# Altium schematic sheet PowerAmplifier915MHz.SchDoc
size A4
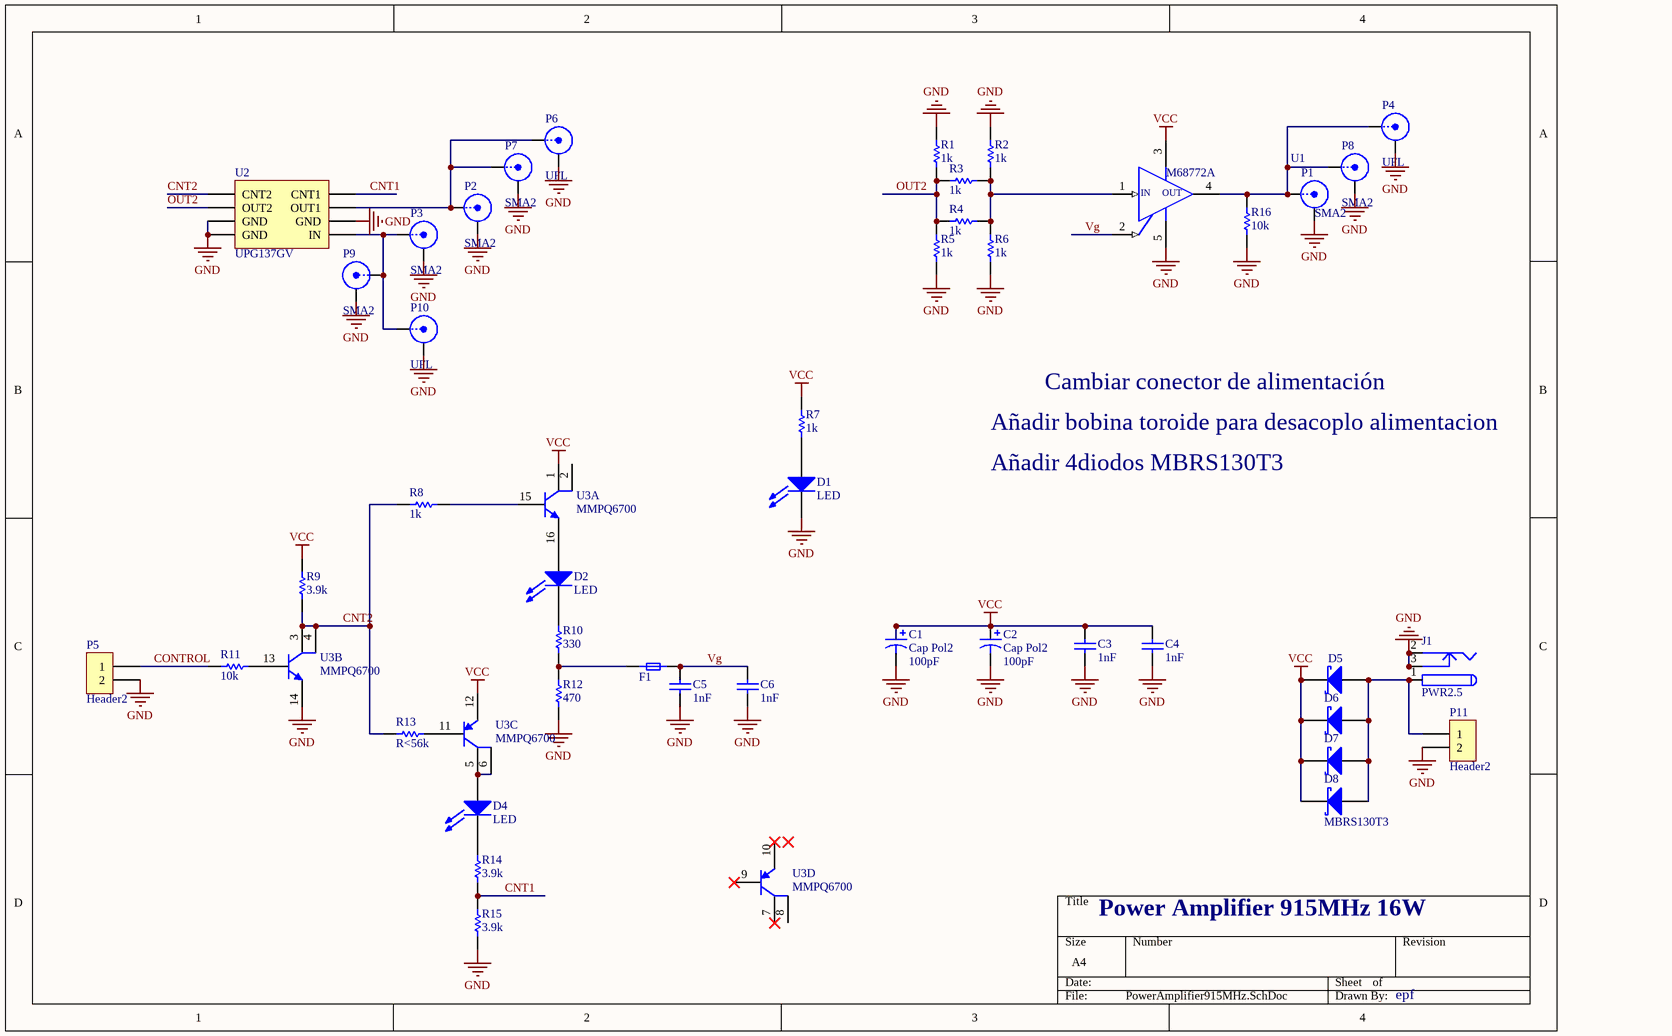
[diagram p0: PowerAmplifier915MHz.SchDoc]

## Parts
C1  Cap Pol2  value 100pF  [TC7360-2924]
C2  Cap Pol2  value 100pF  [TC7360-2924]
C3  value 1nF  [0805_CAP]  (hidden comment: Capacitor)
C4  value 1nF  [0805_CAP]  (hidden comment: Capacitor)
C5  value 1nF  [0805_CAP]  (hidden comment: Capacitor)
C6  value 1nF  [0805_CAP]  (hidden comment: Capacitor)
D1  LED  [LED0603]
D2  LED  [LED0603]
D4  LED  [LED0603]
D5  MBRS130T3  [MBRS130T3]  (value not drawn)
D6  MBRS130T3  [MBRS130T3]  (value not drawn)
D7  MBRS130T3  [MBRS130T3]  (value not drawn)
D8  MBRS130T3  [MBRS130T3]
F1  Ferrita  [IND0603]  (value not drawn)
J1  PWR2.5  [KLD-0202]
P1  SMA2  [SMAL_Antena]
P2  SMA2  [SMAL_Antena]
P3  SMA2  [SMAL22]
P4  UFL  [UFL]
P5  Header2  [Header2Macho]
P6  UFL  [UFL]
P7  SMA2  [SMA-4HOLE]
P8  SMA2  [SMA-4HOLE]
P9  SMA2  [SMA-4HOLE]
P10  UFL  [UFL]
P11  Header2  [Header2Macho]
R1  value 1k  [RES0805]  (hidden comment: Resistor)
R2  value 1k  [RES0805]  (hidden comment: Resistor)
R3  value 1k  [RES0805]  (hidden comment: Resistor)
R4  value 1k  [RES0805]  (hidden comment: Resistor)
R5  value 1k  [RES0805]  (hidden comment: Resistor)
R6  value 1k  [RES0805]  (hidden comment: Resistor)
R7  value 1k  [RES0805]  (hidden comment: Resistor)
R8  value 1k  [RES0805]  (hidden comment: Resistor)
R9  value 3.9k  [RES0805]  (hidden comment: Resistor)
R10  value 330  [RES0805]  (hidden comment: Resistor)
R11  value 10k  [RES0805]  (hidden comment: Resistor)
R12  value 470  [RES0805]  (hidden comment: Resistor)
R13  value R<56k  [RES0805]  (hidden comment: Resistor)
R14  value 3.9k  [RES0805]  (hidden comment: Resistor)
R15  value 3.9k  [RES0805]  (hidden comment: Resistor)
R16  value 10k  [RES0805]  (hidden comment: Resistor)
U1  M68772A  [M68772A]
U2  UPG137GV  [SOP65P640-8L]
U3  MMPQ6700  [SOIC127P602-16BN]  (parts A,B,C,D of 4)

## Nets
GND: C1.2 C2.2 C3.1 C4.1 C5.1 C6.1 D1.2(K) J1.2 J1.2A J1.2B J1.3 J1.3A J1.3B P1.0(Y) P2.0(Y) P3.0(Y) P4.2(Y) P5.2 P6.2(Y) P7.0(Y) P8.0(Y) P9.0(Y) P10.2(Y) P11.2 R1.1 R2.1 R5.2 R6.2 R12.1 R15.1 R16.2 U1.5(GND) U2.3(GND) U2.4(GND) U2.6(GND) U3.14(E)
VCC: C1.1 C2.1 C3.2 C4.2 D5.2(K) D6.2(K) D7.2(K) D8.2(K) R7.2 R9.2 U1.3(Vdd) U3.1(C) U3.12(E)
CNT1: R14.1 R15.2 U2.8(CNT1)
CNT2: R8.1 R9.1 R13.1 U2.1(CNT2) U3.3(C) U3.4(C)
CONTROL: P5.1 R11.1
OUT2: R1.2 R3.1 R4.1 R5.1 U2.2(OUT2)
Vg: C5.2 C6.2 F1.2 U1.2(Vgg)
NetD1_1: D1.1(A) R7.1
NetD2_1: D2.1(A) U3.16(E)
NetD2_2: D2.2(K) R10.2
NetD4_1: D4.1(A) U3.5(C) U3.6(C)
NetD4_2: D4.2(K) R14.2
NetD5_1: D5.1(A) D6.1(A) D7.1(A) D8.1(A) J1.1 J1.1A J1.1B P11.1
NetF1_1: F1.1 R10.1 R12.2
NetP1_1: P1.1(X) P4.1(X) P8.1(X) R16.1 U1.4(OUT)
NetP2_1: P2.1(X) P6.1(X) P7.1(X) U2.7(OUT1)
NetP3_1: P3.1(X) P9.1(X) P10.1(X) U2.5(IN)
NetR2_2: R2.2 R3.2 R4.2 R6.1 U1.1(IN)
NetR8_2: R8.2 U3.15(B)
NetR11_2: R11.2 U3.13(B)
NetR13_2: R13.2 U3.11(B)

Not connected (* = marked no-connect by the designer): U3 2(C) 7(C)* 8(C) 9(B)* 10(E)*

## Notes on the sheet
- Añadir bobina toroide para desacoplo alimentacion
- Cambiar conector de alimentación
- Añadir 4diodos MBRS130T3
- Power Amplifier 915MHz 16W
- epf

## Library data of the parts
C1 C2 = Cap Pol2: Polarized Capacitor (Axial); Published: 8-Jun-2000; LatestRevisionDate: 17-Jul-2002; LatestRevisionNote: Re-released for DXP Platform.; PackageReference: POLAR0.8; Publisher: Altium Limited
C3-C6 = Cap
D1 D2 D4 = LED1
D5-D8 = MBRS130T3: DIODO 1A 30V
J1 = PWR2.5: Low Voltage Power Supply Connector; Published: 17-Dec-2003; DatasheetDocument: 09-May-2002; Publisher: Altium Limited; ComponentLink1Description: Manufacturer Link; ComponentLink1URL: http://domino.kycon.com/internet/Products.html
P1-P3 P7-P9 = SMA2: BNC Elbow Connector; LatestRevisionDate: 17-Jul-2002; LatestRevisionNote: Re-released for DXP Platform.; Publisher: Altium Limited
R1-R16 = Res
U1 = M68772A: AMPLIFICADOR DE POTENCIA 915MHz
U2 = UPG137GV: L-Band SPDT GaAs MMIC SWITCH
U3 = MMPQ6700: Quad NPN & PNP General Purpose Amplifier